# EasyEDA schematic MainControlUnit_schematic.json
TITLE: Sheet_1; REV: 1.0; Date: 2022-12-13; Sheet: 1/1; Drawn By: OnVan; Company: Your Company
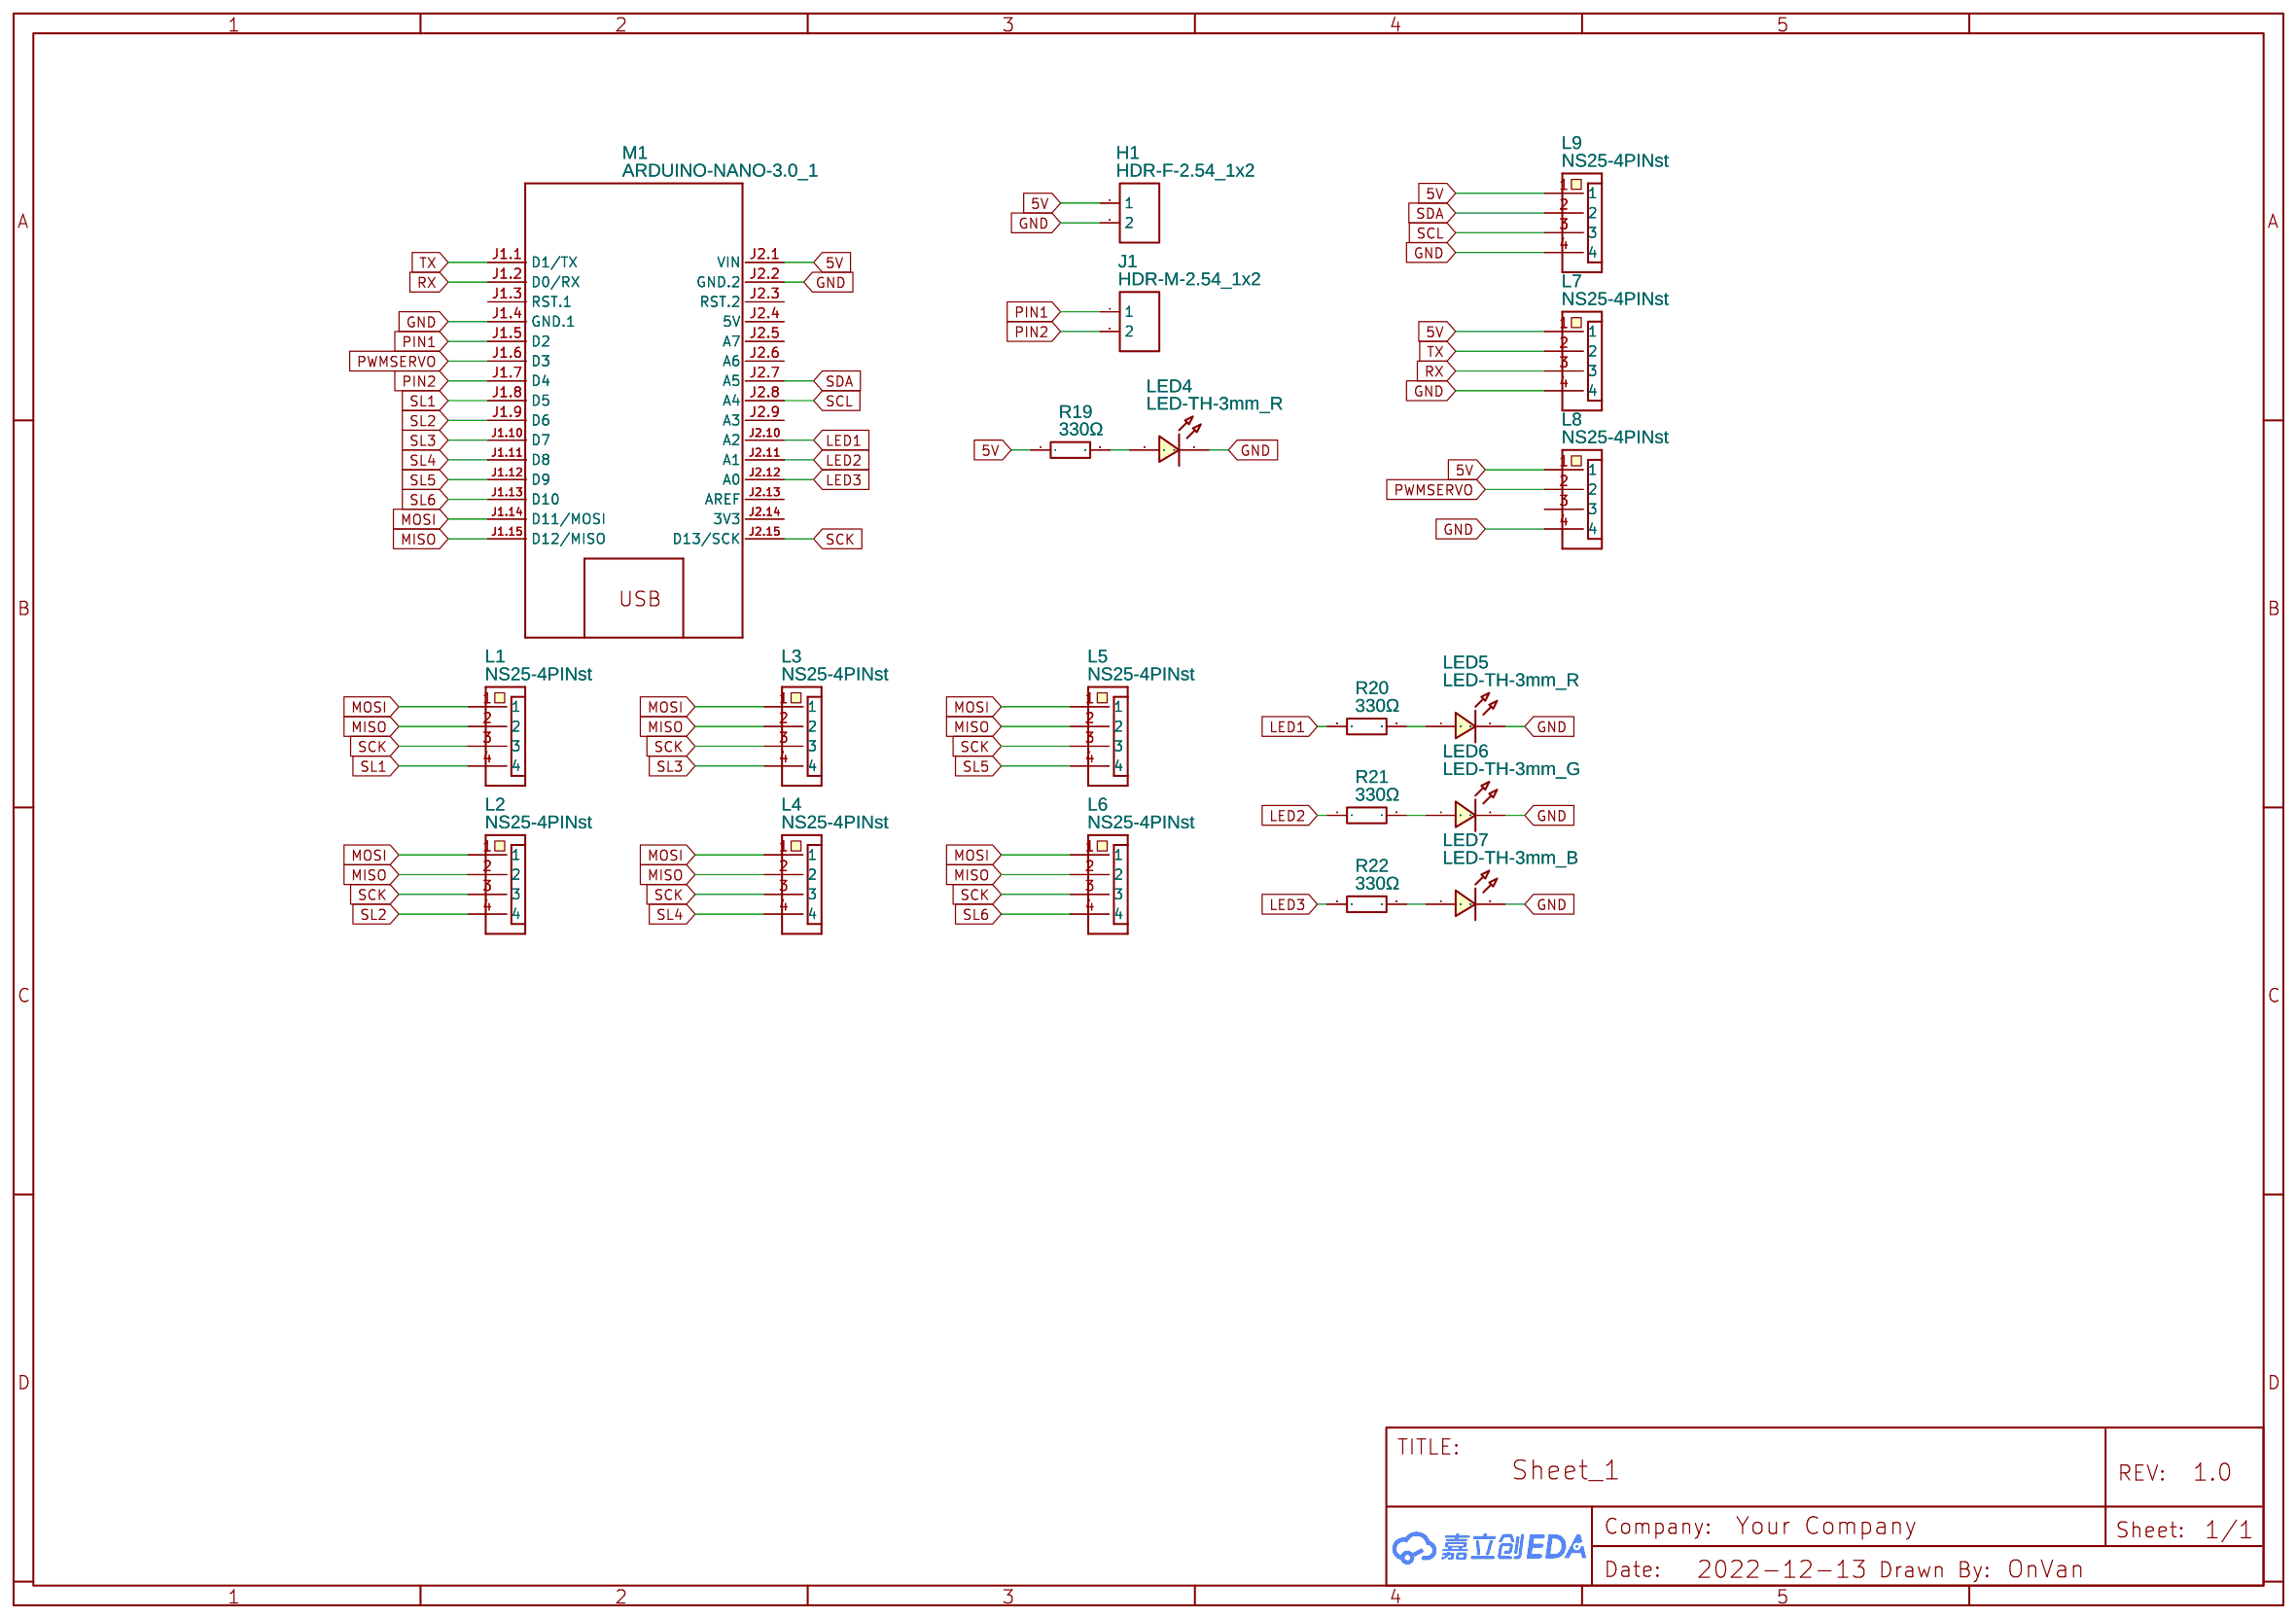
[diagram p0: schematic sheet]

## Parts
H1  HDR-F-2.54_1x2  [HDR-F-2.54_1X2]
J1  HDR-M-2.54_1x2  [HDR-M-2.54_1X2]
L1  NS25-4PINst  [NS25-4PIN]
L2  NS25-4PINst  [NS25-4PIN]
L3  NS25-4PINst  [NS25-4PIN]
L4  NS25-4PINst  [NS25-4PIN]
L5  NS25-4PINst  [NS25-4PIN]
L6  NS25-4PINst  [NS25-4PIN]
L7  NS25-4PINst  [NS25-4PIN]
L8  NS25-4PINst  [NS25-4PIN]
L9  NS25-4PINst  [NS25-4PIN]
LED4  LED-TH-3mm_R  [LED-TH_BD3.0_RED]
LED5  LED-TH-3mm_R  [LED-TH_BD3.0_RED]
LED6  LED-TH-3mm_G  [LED-TH_BD3.0_GREEN]
LED7  LED-TH-3mm_B  [LED-TH_BD3.0_BLUE]
M1  ARDUINO-NANO-3.0_1  [ARDUINO-NANO-3.0]
R19  330Ω  [AXIAL-0.4]
R20  330Ω  [AXIAL-0.4]
R21  330Ω  [AXIAL-0.4]
R22  330Ω  [AXIAL-0.4]

## Library data of the parts
H1 = HDR-F-2.54_1x2: Supplier Part: C49661; Supplier: LCSC; Contributor: LCEDA_Lib
J1 = HDR-M-2.54_1x2: Supplier Part: C124375; Supplier: LCSC; Contributor: LCEDA_Lib
L1-L9 = NS25-4PINst: Contributor: celinasubocz
LED4 LED5 = LED-TH-3mm_R: Manufacturer: EVERLIGHT(台湾亿光); Manufacturer Part: 204-10SDRD/S530-A3-L; Supplier Part: C84774; Supplier: LCSC; Contributor: LCEDA_Lib
LED6 = LED-TH-3mm_G: Manufacturer: EVERLIGHT(台湾亿光); Manufacturer Part: 204-10SYGD/S530-E3; Supplier Part: C85161; Contributor: LCEDA_Lib
LED7 = LED-TH-3mm_B: Manufacturer: EVERLIGHT(台湾亿光); Manufacturer Part: 204-10SUBC/S400-A4; Supplier Part: C86881; Supplier: LCSC; Contributor: LCEDA_Lib
M1 = ARDUINO-NANO-3.0_1: Contributor: fernandovaras
R19 = MFR0W4F3300A50: Supplier: LCSC; Manufacturer: UniOhm; Supplier Part: C58608; Contributor: deepak yadav
R20-R22 = 120Ω: Power: 1/4W; Tolerance: ±1%; Supplier Part: C57439; Supplier: LCSC; Manufacturer: UniOhm; Manufacturer Part: MFR0W4F2200A50

## Nets
5V: H1.1 L7.1 L8.1 L9.1 M1.J2.1(VIN) R19.1
GND: H1.2 L7.4 L8.4 L9.4 LED4.2 LED5.2 LED6.2 LED7.2 M1.J1.4(GND.1) M1.J2.2(GND.2)
LED1: M1.J2.10(A2) R20.1
LED2: M1.J2.11(A1) R21.1
LED3: M1.J2.12(A0) R22.1
MISO: L1.2 L2.2 L3.2 L4.2 L5.2 L6.2 M1.J1.15(D12/MISO)
MOSI: L1.1 L2.1 L3.1 L4.1 L5.1 L6.1 M1.J1.14(D11/MOSI)
PIN1: J1.1 M1.J1.5(D2)
PIN2: J1.2 M1.J1.7(D4)
PWMSERVO: L8.2 M1.J1.6(D3)
RX: L7.3 M1.J1.2(D0/RX)
SCK: L1.3 L2.3 L3.3 L4.3 L5.3 L6.3 M1.J2.15(D13/SCK)
SCL: L9.3 M1.J2.8(A4)
SDA: L9.2 M1.J2.7(A5)
SL1: L1.4 M1.J1.8(D5)
SL2: L2.4 M1.J1.9(D6)
SL3: L3.4 M1.J1.10(D7)
SL4: L4.4 M1.J1.11(D8)
SL5: L5.4 M1.J1.12(D9)
SL6: L6.4 M1.J1.13(D10)
TX: L7.2 M1.J1.1(D1/TX)
Net-(LED4-1): LED4.1 R19.2
Net-(LED5-1): LED5.1 R20.2
Net-(LED6-1): LED6.1 R21.2
Net-(LED7-1): LED7.1 R22.2

Not connected (* = marked no-connect by the designer): L8 3; M1 J1.3(RST.1) J2.3(RST.2) J2.4(5V) J2.5(A7) J2.6(A6) J2.9(A3) J2.13(AREF) J2.14(3V3)
